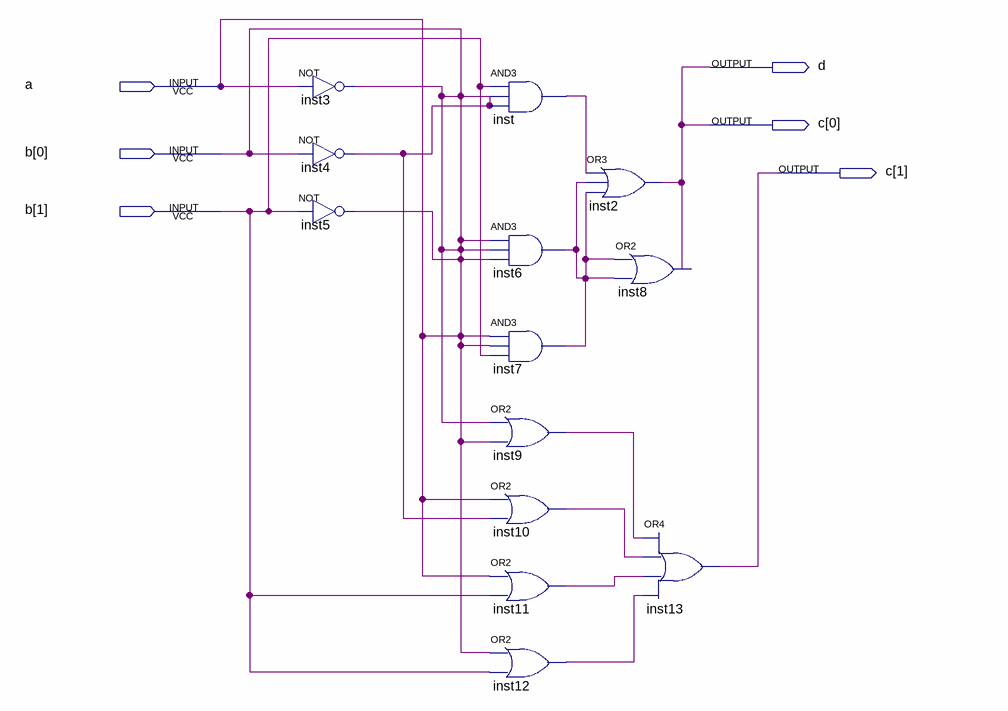
[diagram p0: schematic sheet]
// Quartus schematic Lab11sch.bdf as structural Verilog: 13 symbols, 6 pins
module Lab11sch (
  input  a,
  input  [1:0] b,
  output d,
  output [1:0] c
);

  wire inst6_out, inst9_out, inst10_out, inst11_out, inst12_out, inst_out;

  not inst3 (a, a);
  not inst4 (a, a);
  not inst5 (a, b[1]);
  and inst (inst_out, b[1], a, a);
  and inst6 (inst6_out, a, a, a);
  and inst7 (inst6_out, a, a, b[1]);
  or inst9 (inst9_out, a, a);
  or inst10 (inst10_out, a, a);
  or inst11 (inst11_out, a, b[1]);
  or inst12 (inst12_out, a, b[1]);
  or inst2 (c[0], inst_out, inst6_out, inst6_out);
  or inst8 (c[0], inst6_out, inst6_out);
  or inst13 (c[1], inst9_out, inst10_out, inst11_out, inst12_out);

  assign b[0] = a;
  assign d = c[0];
endmodule
